# Altium schematic sheet SoC_DDR.SchDoc
size A3; SheetNumber: 2; SheetTotal: 6
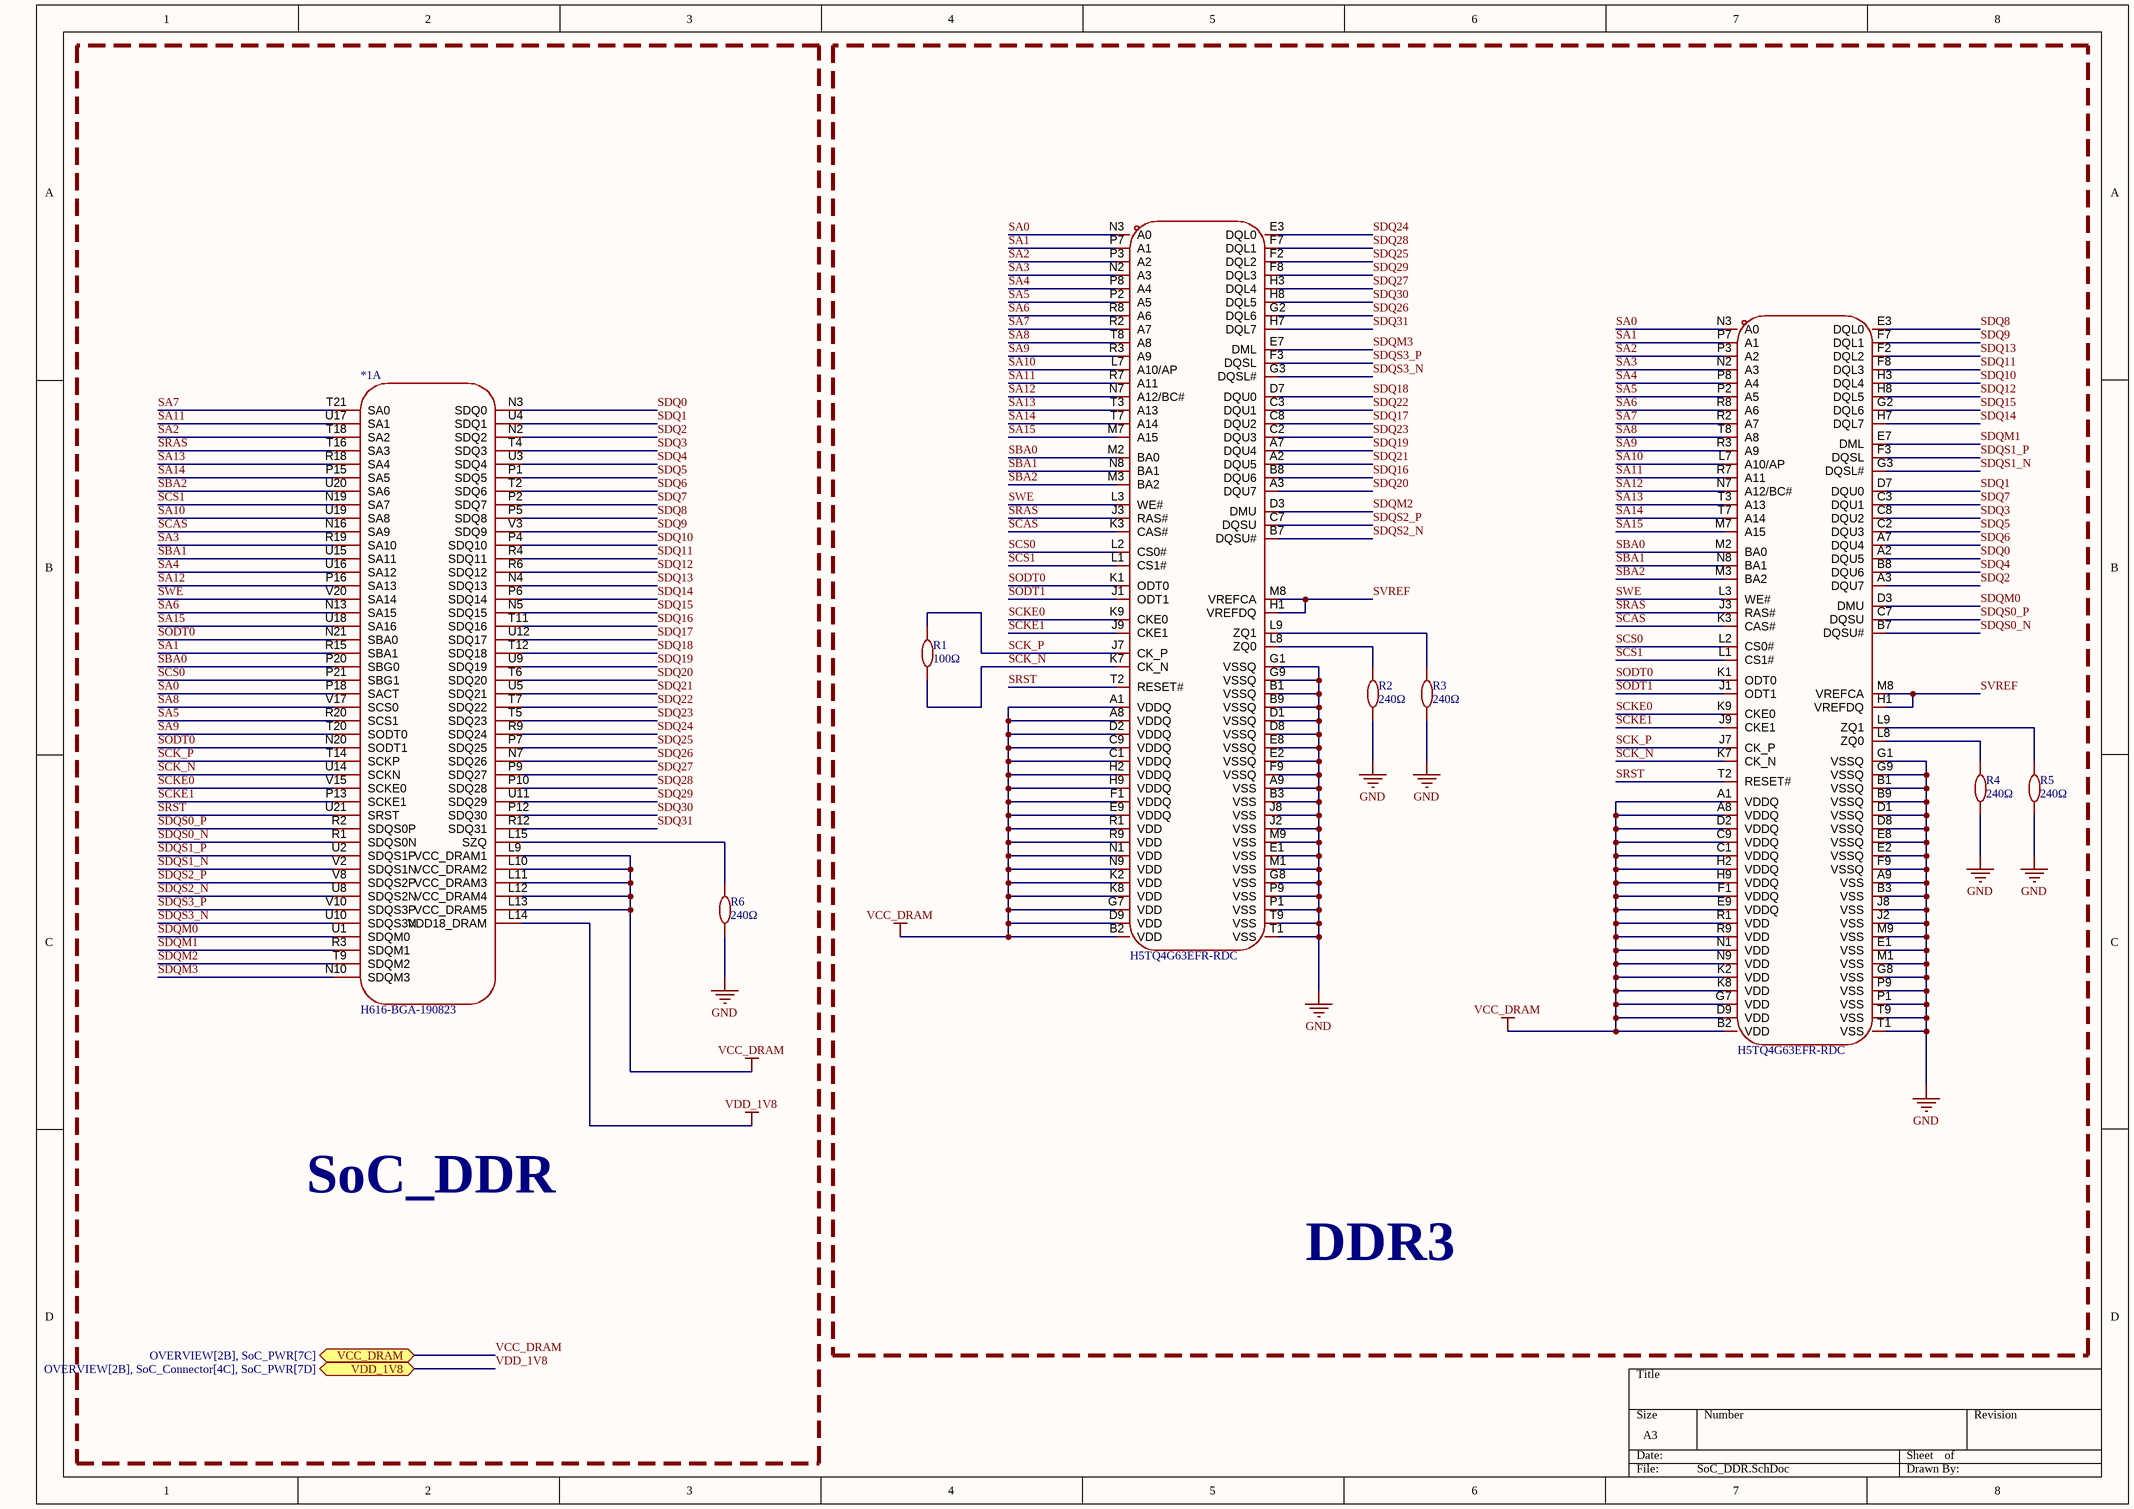
[diagram p0: SoC_DDR.SchDoc]

## Parts
*1  H616-BGA-190823  [BGA-284_L14.0-W12.0-P0.65-TL]  (part A of 4)
R1  100Ω  [R0402]
R2  240Ω  [R0402]
R3  240Ω  [R0402]
R4  240Ω  [R0402]
R5  240Ω  [R0402]
R6  240Ω  [R0402]
U1  H5TQ4G63EFR-RDC  [TFBGA-96_L13.0-W7.5-R16-C6-P0.80-TL]
U2  H5TQ4G63EFR-RDC  [TFBGA-96_L13.0-W7.5-R16-C6-P0.80-TL]

## Blocks framed on the sheet
SoC_DDR: *1 R6
DDR3: R1-R5 U1 U2

## Ports
VCC_DRAM (bidir, see OVERVIEW[2B], SoC_PWR[7C]), VDD_1V8 (bidir, see OVERVIEW[2B], SoC_Connector[4C], SoC_PWR[7D])

## Nets
GND: R2.1 R3.1 R4.1 R5.1 R6.1 U1.A9(VSS) U1.B1(VSSQ) U1.B3(VSS) U1.B9(VSSQ) U1.D1(VSSQ) U1.D8(VSSQ) U1.E1(VSS) U1.E2(VSSQ) U1.E8(VSSQ) U1.F9(VSSQ) U1.G1(VSSQ) U1.G8(VSS) U1.G9(VSSQ) U1.J2(VSS) U1.J8(VSS) U1.M1(VSS) U1.M9(VSS) U1.P1(VSS) U1.P9(VSS) U1.T1(VSS) U1.T9(VSS) U2.A9(VSS) U2.B1(VSSQ) U2.B3(VSS) U2.B9(VSSQ) U2.D1(VSSQ) U2.D8(VSSQ) U2.E1(VSS) U2.E2(VSSQ) U2.E8(VSSQ) U2.F9(VSSQ) U2.G1(VSSQ) U2.G8(VSS) U2.G9(VSSQ) U2.J2(VSS) U2.J8(VSS) U2.M1(VSS) U2.M9(VSS) U2.P1(VSS) U2.P9(VSS) U2.T1(VSS) U2.T9(VSS)
VCC_DRAM: *1.L9(VCC_DRAM1) *1.L10(VCC_DRAM2) *1.L11(VCC_DRAM3) *1.L12(VCC_DRAM4) *1.L13(VCC_DRAM5) U1.A1(VDDQ) U1.A8(VDDQ) U1.B2(VDD) U1.C1(VDDQ) U1.C9(VDDQ) U1.D2(VDDQ) U1.D9(VDD) U1.E9(VDDQ) U1.F1(VDDQ) U1.G7(VDD) U1.H2(VDDQ) U1.H9(VDDQ) U1.K2(VDD) U1.K8(VDD) U1.N1(VDD) U1.N9(VDD) U1.R1(VDD) U1.R9(VDD) U2.A1(VDDQ) U2.A8(VDDQ) U2.B2(VDD) U2.C1(VDDQ) U2.C9(VDDQ) U2.D2(VDDQ) U2.D9(VDD) U2.E9(VDDQ) U2.F1(VDDQ) U2.G7(VDD) U2.H2(VDDQ) U2.H9(VDDQ) U2.K2(VDD) U2.K8(VDD) U2.N1(VDD) U2.N9(VDD) U2.R1(VDD) U2.R9(VDD) ; port VCC_DRAM
VDD_1V8: *1.L14(VDD18_DRAM) ; port VDD_1V8
SA0: *1.P18(SACT) U1.N3(A0) U2.N3(A0)
SA1: *1.R15(SBA1) U1.P7(A1) U2.P7(A1)
SA2: *1.T18(SA2) U1.P3(A2) U2.P3(A2)
SA3: *1.R19(SA10) U1.N2(A3) U2.N2(A3)
SA4: *1.U16(SA12) U1.P8(A4) U2.P8(A4)
SA5: *1.R20(SCS1) U1.P2(A5) U2.P2(A5)
SA6: *1.N13(SA15) U1.R8(A6) U2.R8(A6)
SA7: *1.T21(SA0) U1.R2(A7) U2.R2(A7)
SA8: *1.V17(SCS0) U1.T8(A8) U2.T8(A8)
SA9: *1.T20(SODT0) U1.R3(A9) U2.R3(A9)
SA10: *1.U19(SA8) U1.L7(A10/AP) U2.L7(A10/AP)
SA11: *1.U17(SA1) U1.R7(A11) U2.R7(A11)
SA12: *1.P16(SA13) U1.N7(A12/BC#) U2.N7(A12/BC#)
SA13: *1.R18(SA4) U1.T3(A13) U2.T3(A13)
SA14: *1.P15(SA5) U1.T7(A14) U2.T7(A14)
SA15: *1.U18(SA16) U1.M7(A15) U2.M7(A15)
SBA0: *1.P20(SBG0) U1.M2(BA0) U2.M2(BA0)
SBA1: *1.U15(SA11) U1.N8(BA1) U2.N8(BA1)
SBA2: *1.U20(SA6) U1.M3(BA2) U2.M3(BA2)
SCAS: *1.N16(SA9) U1.K3(CAS#) U2.K3(CAS#)
SCK_N: *1.U14(SCKN) R1.1 U1.K7(CK_N) U2.K7(CK_N)
SCK_P: *1.T14(SCKP) R1.2 U1.J7(CK_P) U2.J7(CK_P)
SCKE0: *1.V15(SCKE0) U1.K9(CKE0) U2.K9(CKE0)
SCKE1: *1.P13(SCKE1) U1.J9(CKE1) U2.J9(CKE1)
SCS0: *1.P21(SBG1) U1.L2(CS0#) U2.L2(CS0#)
SCS1: *1.N19(SA7) U1.L1(CS1#) U2.L1(CS1#)
SDQ0: *1.N3(SDQ0) U2.A2(DQU5)
SDQ1: *1.U4(SDQ1) U2.D7(DQU0)
SDQ2: *1.N2(SDQ2) U2.A3(DQU7)
SDQ3: *1.T4(SDQ3) U2.C8(DQU2)
SDQ4: *1.U3(SDQ4) U2.B8(DQU6)
SDQ5: *1.P1(SDQ5) U2.C2(DQU3)
SDQ6: *1.T2(SDQ6) U2.A7(DQU4)
SDQ7: *1.P2(SDQ7) U2.C3(DQU1)
SDQ8: *1.P5(SDQ8) U2.E3(DQL0)
SDQ9: *1.V3(SDQ9) U2.F7(DQL1)
SDQ10: *1.P4(SDQ10) U2.H3(DQL4)
SDQ11: *1.R4(SDQ11) U2.F8(DQL3)
SDQ12: *1.R6(SDQ12) U2.H8(DQL5)
SDQ13: *1.N4(SDQ13) U2.F2(DQL2)
SDQ14: *1.P6(SDQ14) U2.H7(DQL7)
SDQ15: *1.N5(SDQ15) U2.G2(DQL6)
SDQ16: *1.T11(SDQ16) U1.B8(DQU6)
SDQ17: *1.U12(SDQ17) U1.C8(DQU2)
SDQ18: *1.T12(SDQ18) U1.D7(DQU0)
SDQ19: *1.U9(SDQ19) U1.A7(DQU4)
SDQ20: *1.T6(SDQ20) U1.A3(DQU7)
SDQ21: *1.U5(SDQ21) U1.A2(DQU5)
SDQ22: *1.T7(SDQ22) U1.C3(DQU1)
SDQ23: *1.T5(SDQ23) U1.C2(DQU3)
SDQ24: *1.R9(SDQ24) U1.E3(DQL0)
SDQ25: *1.P7(SDQ25) U1.F2(DQL2)
SDQ26: *1.N7(SDQ26) U1.G2(DQL6)
SDQ27: *1.P9(SDQ27) U1.H3(DQL4)
SDQ28: *1.P10(SDQ28) U1.F7(DQL1)
SDQ29: *1.U11(SDQ29) U1.F8(DQL3)
SDQ30: *1.P12(SDQ30) U1.H8(DQL5)
SDQ31: *1.R12(SDQ31) U1.H7(DQL7)
SDQM0: *1.U1(SDQM0) U2.D3(DMU)
SDQM1: *1.R3(SDQM1) U2.E7(DML)
SDQM2: *1.T9(SDQM2) U1.D3(DMU)
SDQM3: *1.N10(SDQM3) U1.E7(DML)
SDQS0_N: *1.R1(SDQS0N) U2.B7(DQSU#)
SDQS0_P: *1.R2(SDQS0P) U2.C7(DQSU)
SDQS1_N: *1.V2(SDQS1N) U2.G3(DQSL#)
SDQS1_P: *1.U2(SDQS1P) U2.F3(DQSL)
SDQS2_N: *1.U8(SDQS2N) U1.B7(DQSU#)
SDQS2_P: *1.V8(SDQS2P) U1.C7(DQSU)
SDQS3_N: *1.U10(SDQS3N) U1.G3(DQSL#)
SDQS3_P: *1.V10(SDQS3P) U1.F3(DQSL)
SODT0: *1.N20(SODT1) *1.N21(SBA0) U1.K1(ODT0) U2.K1(ODT0)
SODT1: U1.J1(ODT1) U2.J1(ODT1)
SRAS: *1.T16(SA3) U1.J3(RAS#) U2.J3(RAS#)
SRST: *1.U21(SRST) U1.T2(RESET#) U2.T2(RESET#)
SVREF: U1.H1(VREFDQ) U1.M8(VREFCA) U2.H1(VREFDQ) U2.M8(VREFCA)
SWE: *1.V20(SA14) U1.L3(WE#) U2.L3(WE#)
Net*1_L15: *1.L15(SZQ) R6.2
NetR2_2: R2.2 U1.L8(ZQ0)
NetR3_2: R3.2 U1.L9(ZQ1)
NetR4_2: R4.2 U2.L8(ZQ0)
NetR5_2: R5.2 U2.L9(ZQ1)

## Library data of the parts
*1 = H616-BGA-190823: Allwinner H616; Symbol: H616-BGA-190823
R1 = 100Ω: 100Ω 62.5mW 50V ±100ppm/℃ Thick Film Resistor ±1% 0402 Chip Resistor - Surface Mount ROHS
R2-R6 = 240Ω: 240Ω 62.5mW 50V ±100ppm/℃ Thick Film Resistor ±1% 0402 Chip Resistor - Surface Mount ROHS
U1 U2 = H5TQ4G63EFR-RDC: 4Gb DDR3 同步动态随机存取存储器; Symbol: H5TQ4G63EFR-RDC